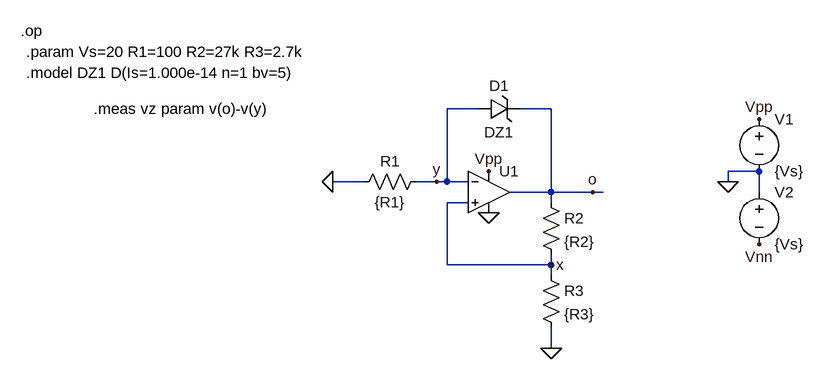
[diagram p0: schematic COMB09op.asc]
COMB09op.asc, the LTspice schematic file:
Version 4
SHEET 1 1720 1076
WIRE 944 80 896 80
WIRE 1056 80 1008 80
WIRE 1376 176 1328 176
WIRE 768 192 720 192
WIRE 880 192 848 192
WIRE 896 192 896 80
WIRE 896 192 880 192
WIRE 928 192 896 192
WIRE 1328 192 1328 176
WIRE 1056 208 1056 80
WIRE 1056 208 992 208
WIRE 1120 208 1056 208
WIRE 1136 208 1120 208
WIRE 1376 208 1376 176
WIRE 928 224 896 224
WIRE 1056 224 1056 208
WIRE 896 320 896 224
WIRE 1056 320 1056 304
WIRE 1056 320 896 320
WIRE 1056 336 1056 320
WIRE 1056 448 1056 416
FLAG 1056 448 0
FLAG 1376 96 Vpp
FLAG 1328 192 0
FLAG 1376 288 Vnn
FLAG 960 176 Vpp
FLAG 720 192 0
FLAG 1120 208 o
FLAG 1056 320 x
FLAG 960 240 0
FLAG 880 192 y
SYMBOL res 1040 208 R0
SYMATTR InstName R2
SYMATTR Value {R2}
SYMBOL res 864 176 R90
WINDOW 0 0 56 VBottom 2
WINDOW 3 32 56 VTop 2
SYMATTR InstName R1
SYMATTR Value {R1}
SYMBOL voltage 1376 80 R0
WINDOW 123 0 0 Left 0
WINDOW 39 0 0 Left 0
SYMATTR InstName V1
SYMATTR Value {Vs}
SYMBOL voltage 1376 192 R0
WINDOW 123 0 0 Left 0
WINDOW 39 0 0 Left 0
SYMATTR InstName V2
SYMATTR Value {Vs}
SYMBOL res 1040 320 R0
SYMATTR InstName R3
SYMATTR Value {R3}
SYMBOL zener 944 96 R270
WINDOW 0 36 32 VTop 2
WINDOW 3 -4 32 VBottom 2
SYMATTR InstName D1
SYMATTR Value DZ1
SYMBOL OpAmps\\UniversalOpAmp2 960 208 R0
SYMATTR InstName U1
TEXT 240 -40 Left 2 !.op
TEXT 248 -8 Left 2 !.param Vs=20 R1=100 R2=27k R3=2.7k
TEXT 248 24 Left 2 !.model DZ1 D(Is=1.000e-14 n=1 bv=5)
TEXT 352 80 Left 2 !.meas vz param v(o)-v(y)

The netlist it stands for:
* COMB09op.asc
R2 o x {R2}
R1 y 0 {R1}
V1 Vpp 0 {Vs}
V2 0 Vnn {Vs}
R3 x 0 {R3}
D1 y o DZ1
XU1 x y Vpp 0 o level2 Avol=1Meg GBW=10Meg Slew=10Meg Ilimit=25m Rail=0 Vos=0 En=0 Enk=0 In=0 Ink=0 Rin=500Meg  ; pins In+ In- V+ V- OUT
.model D D
.lib standard.dio
.op
.param Vs=20 R1=100 R2=27k R3=2.7k
.model DZ1 D(Is=1.000e-14 n=1 bv=5)
.meas vz param v(o)-v(y)
.lib UniversalOpAmp2.lib
.backanno
.end